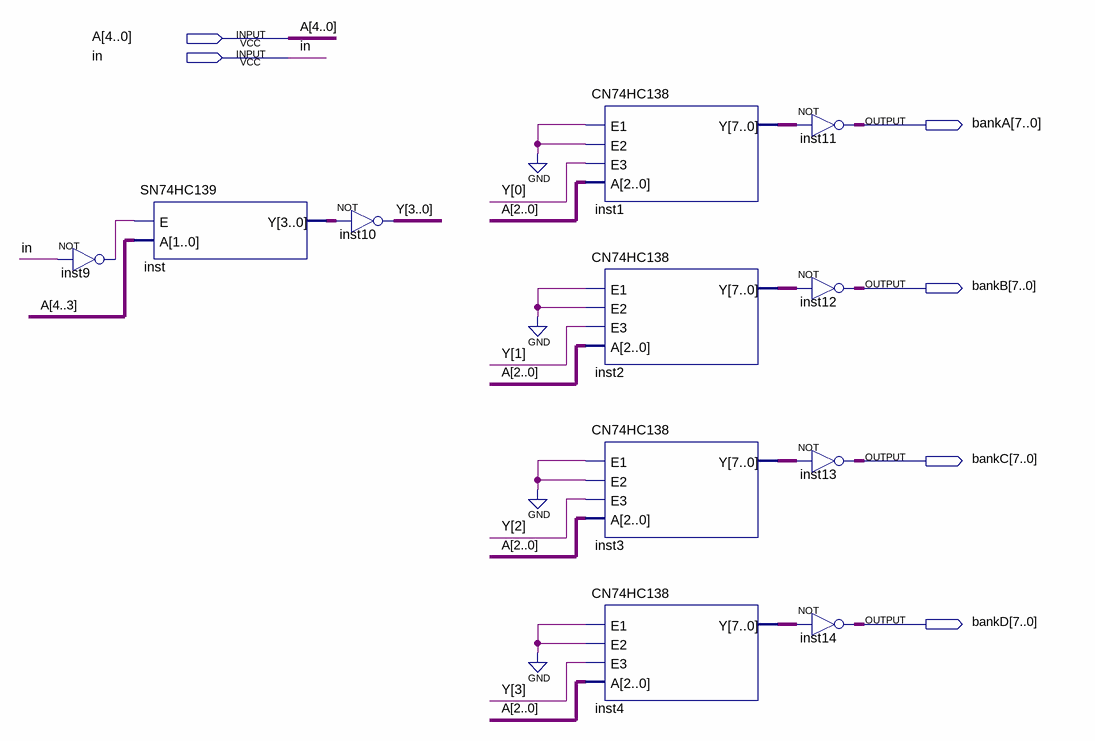
[diagram p0: schematic sheet]
// Quartus schematic demux1x32.bdf as structural Verilog: 11 symbols, 6 pins
module demux1x32 (
  input  [4:0] A,
  input  in,
  output [7:0] bankA,
  output [7:0] bankB,
  output [7:0] bankC,
  output [7:0] bankD
);

  wire inst9_out;
  wire [3:0] inst_y, Y;
  wire [7:0] inst1_y, inst2_y, inst3_y, inst4_y;

  not inst9 (inst9_out, in);
  SN74HC139 inst (.E(inst9_out), .A(A[4:3]), .Y(inst_y));
  assign Y = ~inst_y;  // NOT inst10, 4 bits wide
  CN74HC138 inst1 (.E1(1'b0), .E2(1'b0), .E3(Y[0]), .A(A[2:0]), .Y(inst1_y));
  CN74HC138 inst2 (.E1(1'b0), .E2(1'b0), .E3(Y[1]), .A(A[2:0]), .Y(inst2_y));
  CN74HC138 inst3 (.E1(1'b0), .E2(1'b0), .E3(Y[2]), .A(A[2:0]), .Y(inst3_y));
  CN74HC138 inst4 (.E1(1'b0), .E2(1'b0), .E3(Y[3]), .A(A[2:0]), .Y(inst4_y));
  assign bankA = ~inst1_y;  // NOT inst11, 8 bits wide
  assign bankB = ~inst2_y;  // NOT inst12, 8 bits wide
  assign bankC = ~inst3_y;  // NOT inst13, 8 bits wide
  assign bankD = ~inst4_y;  // NOT inst14, 8 bits wide
endmodule
